# EAGLE schematic interrupcion de bomba (2) (EAGLE 9.0.0)
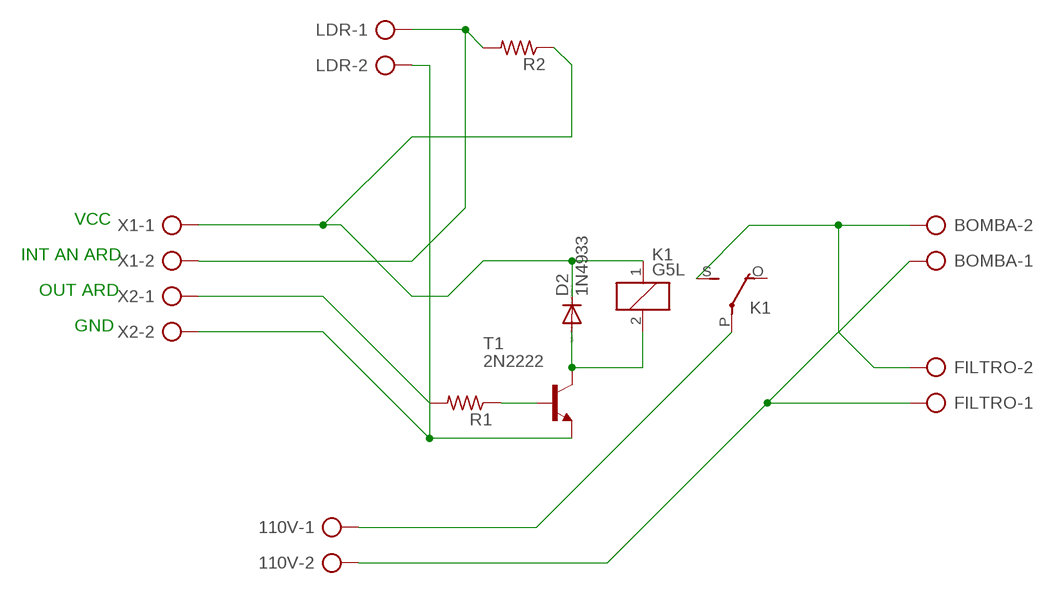
[diagram p0: schematic, sheet 1]

## Parts
110V  AK500/2-H  [AK500/2-H]
BOMBA  AK500/2-H  [AK500/2-H]
D2  1N4933  [DO41-10]
FILTRO  AK500/2-H  [AK500/2-H]
K1  G5L  [G5LE]
LDR  AK500/2-H  [AK500/2-H]
R1  R-US_0207/10  [0207/10]
R2  R-US_0207/10  [0207/10]
T1  2N2222  [TO18]
X1  AK500/2-H  [AK500/2-H]
X2  AK500/2-H  [AK500/2-H]

## Nets
N$1: R1.1 T1.2(B)
N$2: D2.A K1.2 T1.3(C)
N$3: D2.C K1.1 R2.1 X1.1
N$4: 110V.1 K1.P(2:P)
N$5: BOMBA.2 FILTRO.2 K1.S(2:S)
N$6: R1.2 X2.1
N$7: 110V.2 BOMBA.1 FILTRO.1
N$8: LDR.2 T1.1(E) X2.2
N$9: LDR.1 R2.2 X1.2
Unconnected: K1.O(2:O)

## Notes on the sheet
- VCC
- INT AN ARD
- OUT ARD
- GND

## Library data of the parts
110V BOMBA FILTRO LDR X1 X2 = con-ptr500:AK500/2-H: CONNECTOR Aug. 2004 / PTR Meßtechnik: Die Bezeichnung der Serie AK505 wurde geändert. Es handelt sich hierbei um AK500 in horizontaler Ausführung.; OC_FARNELL: unknown; OC_NEWARK: unknown
D2 = diode:1N4933: DIODE fast recovery rectifier, 1A
K1 = relay:G5L: RELAY 1 x switch, 10 A/120 V AC, 8 A/30 V ADC, Omron; OC_FARNELL: unknown; OC_NEWARK: unknown
R1 R2 = rcl:R-US_: RESISTOR, American symbol; SPICEPREFIX: R
T1 = transistor-neu-to92:2N2222: NPN TRANSISTOR